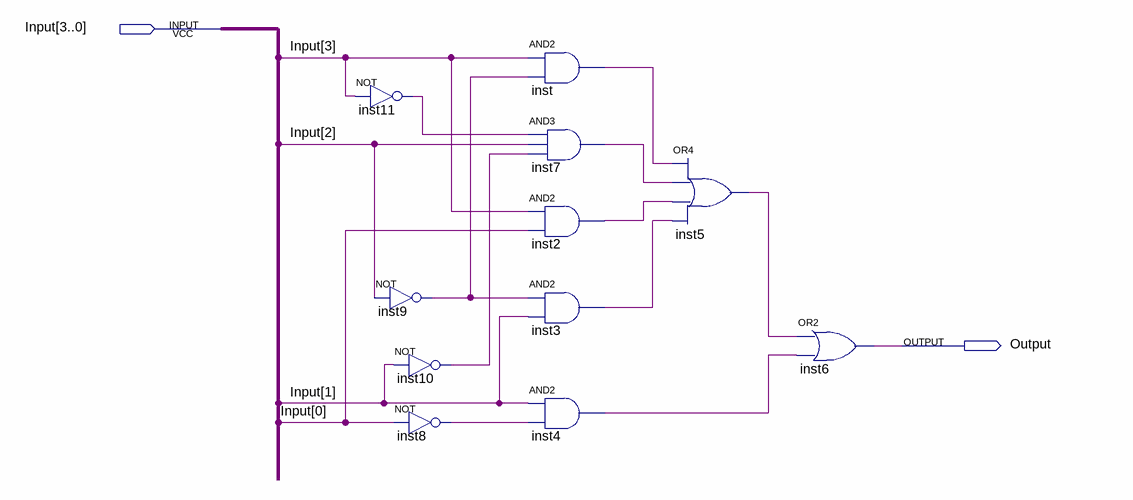
[diagram p0: schematic sheet]
// Quartus schematic display_g.bdf as structural Verilog: 11 symbols, 2 pins
module display_g (
  input  [3:0] Input,
  output Output
);

  wire inst2_out, inst3_out, inst4_out, inst5_out, inst7_out, inst8_out, inst9_out, inst10_out, inst11_out,
       inst_out;

  not inst11 (inst11_out, Input[3]);
  not inst9 (inst9_out, Input[2]);
  not inst10 (inst10_out, Input[1]);
  not inst8 (inst8_out, Input[0]);
  and inst (inst_out, Input[3], inst9_out);
  and inst7 (inst7_out, inst11_out, Input[2], inst10_out);
  and inst2 (inst2_out, Input[3], Input[0]);
  and inst3 (inst3_out, inst9_out, Input[1]);
  and inst4 (inst4_out, Input[1], inst8_out);
  or inst5 (inst5_out, inst_out, inst7_out, inst2_out, inst3_out);
  or inst6 (Output, inst5_out, inst4_out);
endmodule
